# EAGLE schematic temperature_sensor_v2 (EAGLE 9.6.2)
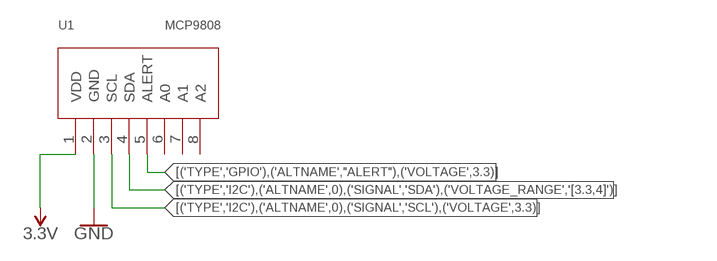
[diagram p0: schematic, sheet 1]

## Parts
U1  MCP9808  [MCP9808]

## Nets
3.3V: U1.1(VDD)
[('TYPE','GPIO'),('ALTNAME',"ALERT"),('VOLTAGE',3.3)]: U1.5(ALERT)
[('TYPE','I2C'),('ALTNAME',0),('SIGNAL','SCL'),('VOLTAGE',3.3)]: U1.3(SCL)
[('TYPE','I2C'),('ALTNAME',0),('SIGNAL','SDA'),('VOLTAGE_RANGE','[3.3,4]')]: U1.4(SDA)
GND: U1.2(GND)
Unconnected: U1.6(A0) U1.7(A1) U1.8(A2)

## Library data of the parts
U1 = MCP9808:MCP9808